# EAGLE design lighting_led (EAGLE 9.7.0)
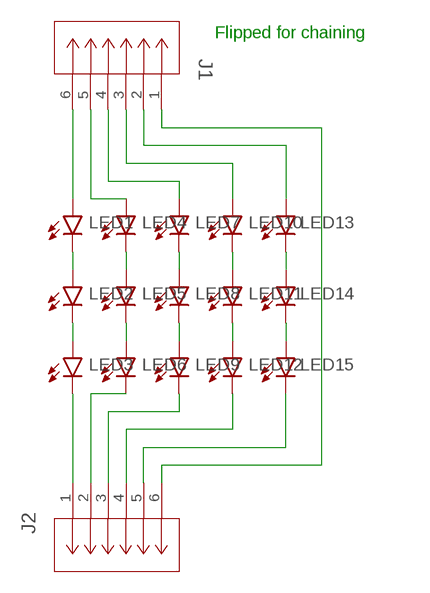
[diagram p0: schematic, sheet 1]

## Parts
J1  MOLEX-MICROLOCK-6PIN  [CON_5055670671]
J2  MOLEX-MICROLOCK-6PIN  [CON_5055670671]
LED1  XP-G3_BLUE  [XLAMP_XP-G3_BLUE]
LED2  XP-G3_BLUE  [XLAMP_XP-G3_BLUE]
LED3  XP-G3_BLUE  [XLAMP_XP-G3_BLUE]
LED4  XP-G3_COOL  [XLAMP_XP-G3_COOL]
LED5  XP-G3_COOL  [XLAMP_XP-G3_COOL]
LED6  XP-G3_COOL  [XLAMP_XP-G3_COOL]
LED7  XP-G3_WARM  [XLAMP_XP-G3_WARM]
LED8  XP-G3_WARM  [XLAMP_XP-G3_WARM]
LED9  XP-G3_WARM  [XLAMP_XP-G3_WARM]
LED10  XP-G3_RED  [XLAMP_XP-G3_RED]
LED11  XP-G3_RED  [XLAMP_XP-G3_RED]
LED12  XP-G3_RED  [XLAMP_XP-G3_RED]
LED13  XLAMP_XP-E2  [XLAMP_XP-E2]
LED14  XLAMP_XP-E2  [XLAMP_XP-E2]
LED15  XLAMP_XP-E2  [XLAMP_XP-E2]

## Nets
N$1: LED4.P$2(C) LED5.P$1(A)
N$2: LED1.P$2(C) LED2.P$1(A)
N$3: LED2.P$2(C) LED3.P$1(A)
N$4: LED5.P$2(C) LED6.P$1(A)
N$5: LED7.P$2(C) LED8.P$1(A)
N$6: LED8.P$2(C) LED9.P$1(A)
N$7: LED10.P$2(C) LED11.P$1(A)
N$8: LED11.P$2(C) LED12.P$1(A)
N$9: LED13.P$2(C) LED14.P$1(A)
N$10: LED14.P$2(C) LED15.P$1(A)
N$11: J1.6 LED1.P$1(A)
N$12: J1.5 LED4.P$1(A)
N$13: J1.4 LED7.P$1(A)
N$14: J1.3 LED10.P$1(A)
N$15: J1.2 LED13.P$1(A)
N$16: J1.1 J2.6
N$18: J2.5 LED15.P$2(C)
N$19: J2.4 LED12.P$2(C)
N$20: J2.3 LED9.P$2(C)
N$21: J2.2 LED6.P$2(C)
N$22: J2.1 LED3.P$2(C)

## Notes on the sheet
- Flipped for chaining

## Library data of the parts
J1 J2 = Molex Micro-Lock PLUS 6-Pin 90deg:MOLEX-MICROLOCK-6PIN
LED1-LED3 = XLAMP XP-G3:XP-G3_BLUE
LED4-LED6 = XLAMP XP-G3:XP-G3_COOL
LED7-LED9 = XLAMP XP-G3:XP-G3_WARM
LED10-LED12 = XLAMP XP-G3:XP-G3_RED
LED13-LED15 = Cree XLAMP XP-E2:XLAMP_XP-E2

## Net classes
0 default: width 0.254 mm, clearance 0.508 mm

## Board
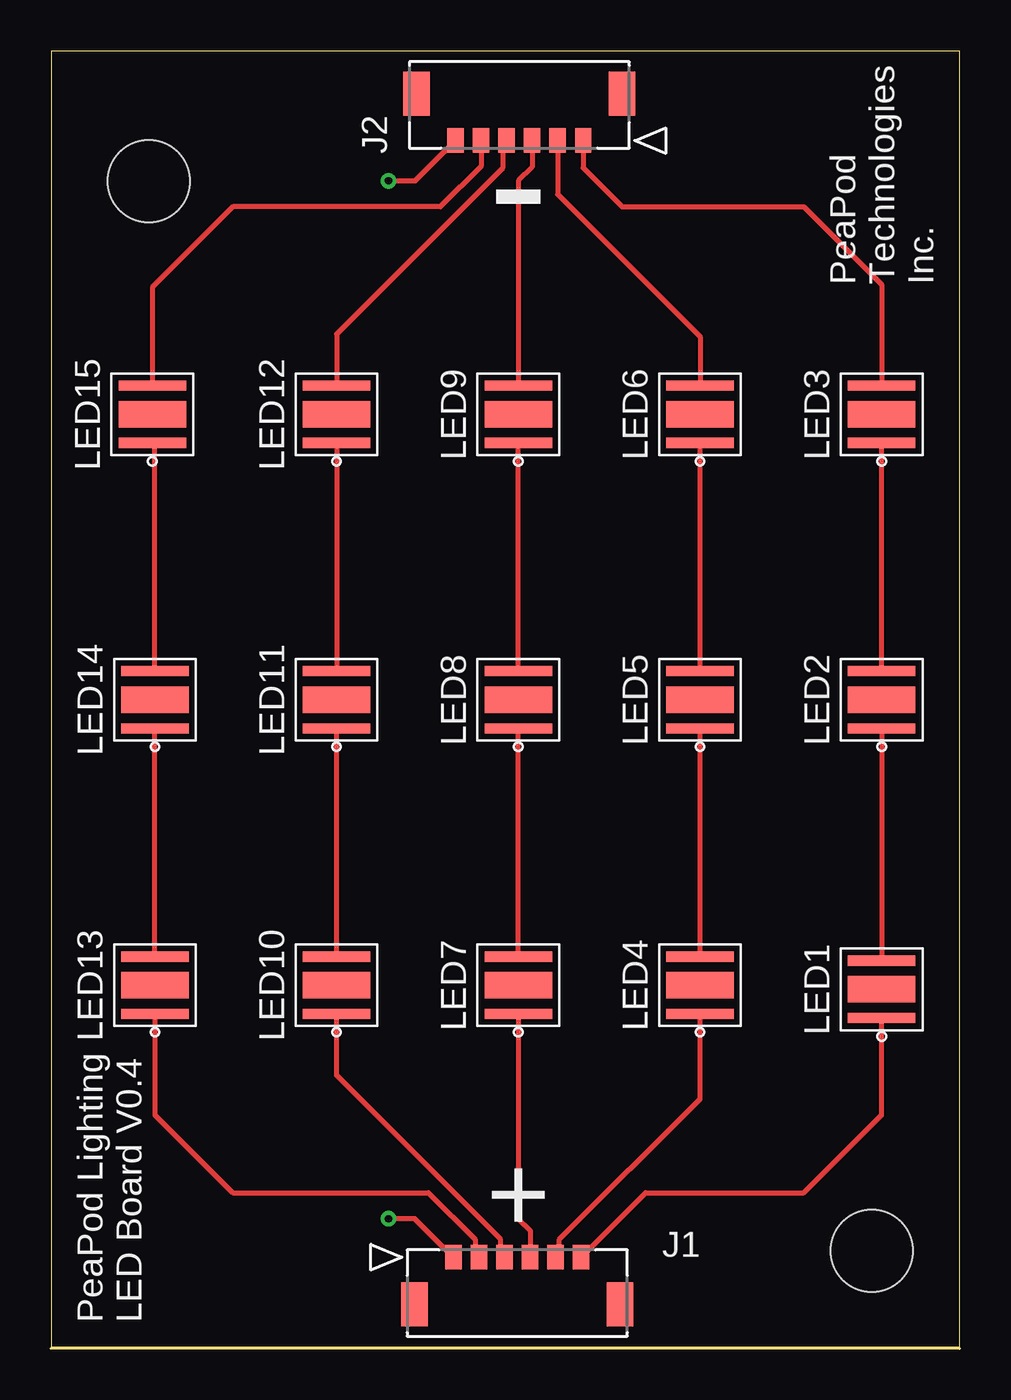
[diagram p1: board, top side]
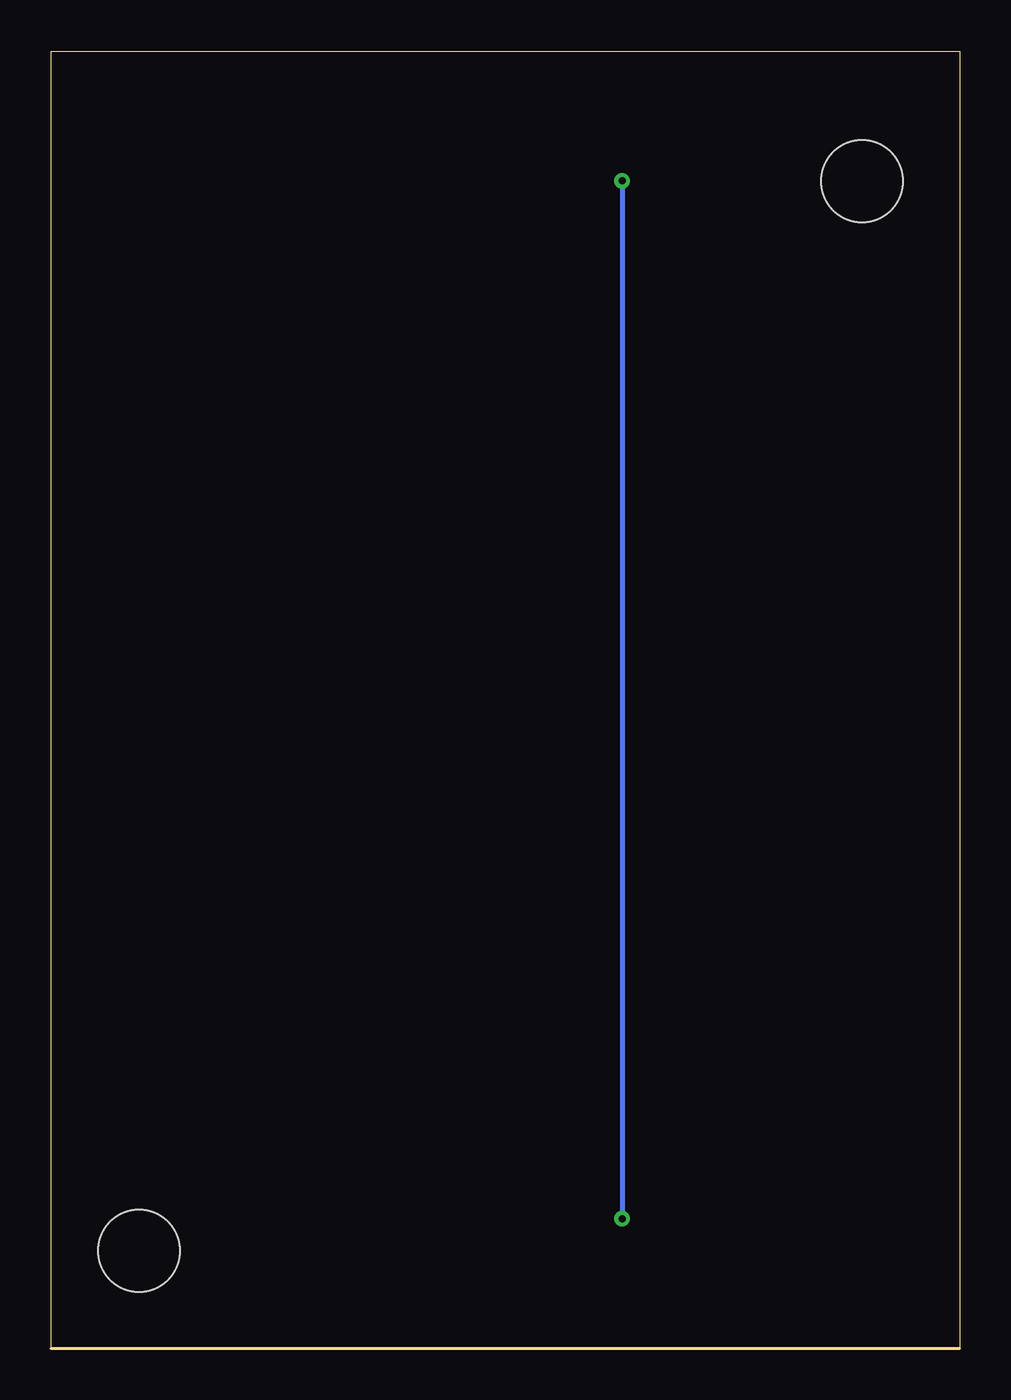
[diagram p2: board, bottom side, seen from below]

Size 44.45 x 63.5 mm. Coordinates in mm from the lower left corner, seen from the top.
Outline: 44.45,0 44.45,63.5 0,63.5 0,0 44.45,0
Copper layers (1*16): Top 0.035mm / dielectric 1.5mm / Bottom 0.035mm
Design rules "default": minimum track width 6mil, minimum drill 0.35mm, track to track 6mil, track to pad 6mil, pad to pad 6mil, via to via 6mil, smd to smd 6mil, copper to edge 40mil, drill to drill 6mil, minimum pad ring 10mil, minimum via ring 8mil, stop-mask expansion 4mil, vias tented up to drill 0mil, thermal gap 10mil
Holes 4 mm at 4.78,57.12 40.15,4.77

### Footprints (pad centres in the part's own frame; a part is rotated, then mirrored left to right if it is on the bottom)
CON_5055670671 = smd 0.8 x 1.2: 1 0,0; 2 -1.25,0; 3 -2.5,0; 4 -3.75,0; 5 -5,0; 6 -6.25,0 | smd 1.3 x 2.15: NC1 -8.15,2.295; NC2 1.9,2.295
XLAMP_XP-G3_BLUE = smd 1.3 x 3.3: NC 0,0 | smd 0.5 x 3.3: P$1 -1.4,0; P$2 1.4,0
XLAMP_XP-G3_COOL = smd 1.3 x 3.3: NC 0,0 | smd 0.5 x 3.3: P$1 -1.4,0; P$2 1.4,0
XLAMP_XP-G3_WARM = smd 1.3 x 3.3: NC 0,0 | smd 0.5 x 3.3: P$1 -1.4,0; P$2 1.4,0
XLAMP_XP-G3_RED = smd 1.3 x 3.3: NC 0,0 | smd 0.5 x 3.3: P$1 -1.4,0; P$2 1.4,0
XLAMP_XP-E2 = smd 1.3 x 3.3: NC 0,0 | smd 0.5 x 3.3: P$1 -1.4,0; P$2 1.4,0

### Placement (x,y rotation side)
J1  19.68,4.46 180 top
J2  26.04,59.11 0 top
LED1  40.64,17.58 90 top
LED2  40.64,31.75 90 top
LED3  40.64,45.72 90 top
LED4  31.75,17.78 90 top
LED5  31.75,31.75 90 top
LED6  31.75,45.72 90 top
LED7  22.86,17.78 90 top
LED8  22.86,31.75 90 top
LED9  22.86,45.72 90 top
LED10  13.97,17.78 90 top
LED11  13.97,31.75 90 top
LED12  13.97,45.72 90 top
LED13  5.08,17.78 90 top
LED14  5.08,31.75 90 top
LED15  4.95,45.72 90 top

### Tracks (layer width: path | path; a pad name or v marks a point on that pad's centre or on a via)
N$1
  Top 0.254: LED4.P$2 LED5.P$1
N$2
  Top 0.254: LED2.P$1 LED1.P$2
N$3
  Top 0.254: LED2.P$2 LED3.P$1
N$4
  Top 0.254: LED5.P$2 LED6.P$1
N$5
  Top 0.254: LED7.P$2 LED8.P$1
N$6
  Top 0.254: LED8.P$2 LED9.P$1
N$7
  Top 0.254: LED10.P$2 LED11.P$1
N$8
  Top 0.254: LED12.P$1 LED11.P$2
N$9
  Top 0.254: LED13.P$2 LED14.P$1
N$10
  Top 0.254: LED14.P$2 5.08,44.19 LED15.P$1
N$11
  Top 0.254: J1.6 29.09,7.62 36.83,7.62 40.64,11.43 LED1.P$1
N$12
  Top 0.254: J1.5 24.88,4.65 24.88,5.34 31.75,12.21 LED4.P$1
N$13
  Top 0.254: J1.4 23.43,5.77 22.86,6.35 LED7.P$1
N$14
  Top 0.254: J1.3 22,4.65 22,5.34 13.97,13.36 LED10.P$1
N$15
  Top 0.254: LED13.P$1 5.08,11.43 8.89,7.62 18.46,7.62 20.75,5.34 20.75,4.65 J1.2
N$16  (via drill 0.35)
  Top 0.254: J2.6 17.82,57.15 v16.51,57.15 | v16.51,6.35 17.8,6.35 J1.1
  Bottom 0.254: v16.51,57.15 v16.51,6.35
N$18
  Top 0.254: J2.5 21.04,57.87 19.05,55.88 8.89,55.88 4.95,51.94 LED15.P$2
N$19
  Top 0.254: J2.4 22.09,58.92 22.09,57.78 13.97,49.65 LED12.P$2
N$20
  Top 0.254: J2.3 23.54,57.83 22.86,57.15 LED9.P$2
N$21
  Top 0.254: J2.2 24.79,56.49 31.75,49.53 LED6.P$2
N$22
  Top 0.254: J2.1 26.04,57.79 27.94,55.88 36.83,55.88 40.64,52.07 LED3.P$2

### Text on the board
tPlace: - | PeaPod / Technologies / Inc. | + | PeaPod Lighting / LED Board V0.4